# Altium schematic sheet Power.SchDoc: Power Converters
size 279 x 215 mm; DrawnBy: Kyle Hong; Engineer: Kyle Hong; Revision: 1; SheetNumber: 1; SheetTotal: 3
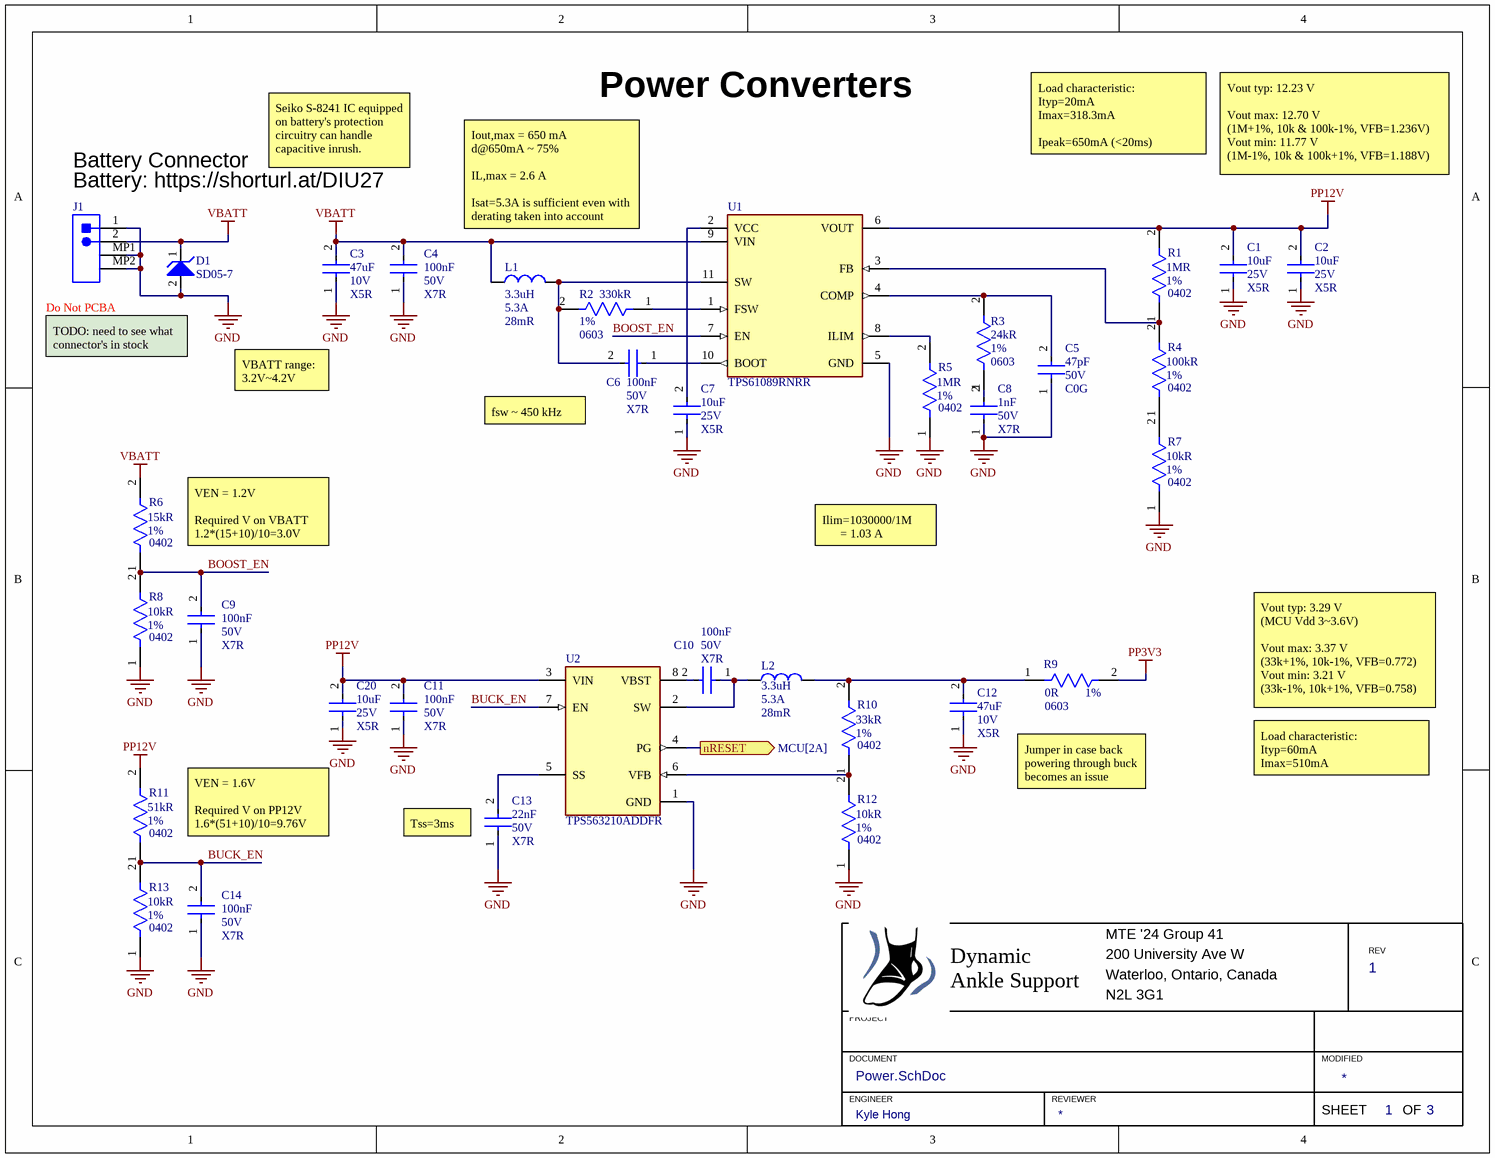
[diagram p0: Power.SchDoc]

## Parts
C1  Dielectric: X5R  Voltage Rating: 25V  Capacitance: 10uF  [CAP0805]  (hidden comment: CL21A106KAYNNNE)
C2  Dielectric: X5R  Voltage Rating: 25V  Capacitance: 10uF  [CAP0805]  (hidden comment: CL21A106KAYNNNE)
C3  Dielectric: X5R  Voltage Rating: 10V  Capacitance: 47uF  [CAP1206]  (hidden comment: CL31A476MPHNNNE)
C4  Dielectric: X7R  Voltage Rating: 50V  Capacitance: 100nF  [CAP0402]  (hidden comment: CL05B104KB54PNC)
C5  Dielectric: C0G  Voltage Rating: 50V  Capacitance: 47pF  [CAP0402]  (hidden comment: 0402CG470J500NT)
C6  Dielectric: X7R  Voltage Rating: 50V  Capacitance: 100nF  [CAP0402]  (hidden comment: CL05B104KB54PNC)
C7  Dielectric: X5R  Voltage Rating: 25V  Capacitance: 10uF  [CAP0805]  (hidden comment: CL21A106KAYNNNE)
C8  Dielectric: X7R  Voltage Rating: 50V  Capacitance: 1nF  [CAP0402]  (hidden comment: 0402B102K500NT)
C9  Dielectric: X7R  Voltage Rating: 50V  Capacitance: 100nF  [CAP0402]  (hidden comment: CL05B104KB54PNC)
C10  Dielectric: X7R  Voltage Rating: 50V  Capacitance: 100nF  [CAP0402]  (hidden comment: CL05B104KB54PNC)
C11  Dielectric: X7R  Voltage Rating: 50V  Capacitance: 100nF  [CAP0402]  (hidden comment: CL05B104KB54PNC)
C12  Dielectric: X5R  Voltage Rating: 10V  Capacitance: 47uF  [CAP1206]  (hidden comment: CL31A476MPHNNNE)
C13  Dielectric: X7R  Voltage Rating: 50V  Capacitance: 22nF  [CAP0402]  (hidden comment: 0402B223K500NT)
C14  Dielectric: X7R  Voltage Rating: 50V  Capacitance: 100nF  [CAP0402]  (hidden comment: CL05B104KB54PNC)
C20  Dielectric: X5R  Voltage Rating: 25V  Capacitance: 10uF  [CAP0805]  (hidden comment: CL21A106KAYNNNE)
D1  SD05-7  [SD05-7]
J1  S2B-PH-SM4-TB(LF)(SN)  [JST- S2B-PH-SM4-TB(LF)(SN)-2_V]  (value not drawn)
L1  DC Resistance: 28mR  Isat(min): 5.3A  Inductance: 3.3uH  [TMPA0503S-3R3MN-D]  (hidden comment: TMPA0503S-3R3MN-D)
L2  DC Resistance: 28mR  Isat(min): 5.3A  Inductance: 3.3uH  [TMPA0503S-3R3MN-D]  (hidden comment: TMPA0503S-3R3MN-D)
R1  Tolerance: 1%  Resistance: 1MR  Package: 0402  [RES0402]  (hidden comment: 0402WGF1004TCE)
R2  Tolerance: 1%  Resistance: 330kR  Package: 0603  [RES0603]  (hidden comment: 0603WAF3303T5E)
R3  Tolerance: 1%  Resistance: 24kR  Package: 0603  [RES0603]  (hidden comment: 0603WAF2402T5E)
R4  Tolerance: 1%  Resistance: 100kR  Package: 0402  [RES0402]  (hidden comment: 0402WGF1003TCE)
R5  Tolerance: 1%  Resistance: 1MR  Package: 0402  [RES0402]  (hidden comment: 0402WGF1004TCE)
R6  Tolerance: 1%  Resistance: 15kR  Package: 0402  [RES0402]  (hidden comment: 0402WGF1502TCE)
R7  Tolerance: 1%  Resistance: 10kR  Package: 0402  [RES0402]  (hidden comment: 0402WGF1002TCE)
R8  Tolerance: 1%  Resistance: 10kR  Package: 0402  [RES0402]  (hidden comment: 0402WGF1002TCE)
R9  Tolerance: 1%  Resistance: 0R  Package: 0603  [RES0603]  (hidden comment: 0603WAF0000T5E)
R10  Tolerance: 1%  Resistance: 33kR  Package: 0402  [RES0402]  (hidden comment: 0402WGF3302TCE)
R11  Tolerance: 1%  Resistance: 51kR  Package: 0402  [RES0402]  (hidden comment: 0402WGF5102TCE)
R12  Tolerance: 1%  Resistance: 10kR  Package: 0402  [RES0402]  (hidden comment: 0402WGF1002TCE)
R13  Tolerance: 1%  Resistance: 10kR  Package: 0402  [RES0402]  (hidden comment: 0402WGF1002TCE)
U1  TPS61089RNRR  [FP-RNR0011A-MFG]
U2  TPS563210ADDFR  [TPS563210ADDFR]

## Ports
nRESET (out, see MCU[2A])

## Nets
GND: C1.1 C2.1 C3.1 C4.1 C5.1 C7.1 C8.1 C9.1 C11.1 C12.1 C13.1 C14.1 C20.1 D1.2 J1.1 J1.MP1 J1.MP2 R5.1 R7.1 R8.1 R12.1 R13.1 U1.5(GND) U2.1(GND)
PP3V3: R9.2
PP12V: C1.2 C2.2 C11.2 C20.2 R1.2 R11.2 U1.6(VOUT) U2.3(VIN)
VBATT: C3.2 C4.2 D1.1 J1.2 L1.1 R6.2 U1.9(VIN)
BOOST_EN: C9.2 R6.1 R8.2 U1.7(EN)
BUCK_EN: C14.2 R11.1 R13.2 U2.7(EN)
nRESET: U2.4(PG) ; port nRESET
NetC5_2: C5.2 R3.2 U1.4(COMP)
NetC6_1: C6.1 U1.10(BOOT)
NetC6_2: C6.2 L1.2 R2.2 U1.11(SW)
NetC7_2: C7.2 U1.2(VCC)
NetC8_2: C8.2 R3.1
NetC10_1: C10.1 L2.1 U2.2(SW)
NetC10_2: C10.2 U2.8(VBST)
NetC12_2: C12.2 L2.2 R9.1 R10.2
NetC13_2: C13.2 U2.5(SS)
NetR1_1: R1.1 R4.2 U1.3(FB)
NetR2_1: R2.1 U1.1(FSW)
NetR4_1: R4.1 R7.2
NetR5_2: R5.2 U1.8(ILIM)
NetR10_1: R10.1 R12.2 U2.6(VFB)

## Notes on the sheet
- Power Converters
- Seiko S-8241 IC equipped on battery's protection circuitry can handle capacitive inrush.
- Load characteristic:
  Ityp=20mA
  Imax=318.3mA
  Ipeak=650mA (<20ms)
- Battery Connector
- (near J1) Battery: https://shorturl.at/DIU27
- Iout,max = 650 mA
  d@650mA ~ 75%
  IL,max = 2.6 A
  Isat=5.3A is sufficient even with derating taken into account
- Vout typ: 12.23 V
  Vout max: 12.70 V
  (1M+1%, 10k & 100k-1%, VFB=1.236V)
  Vout min: 11.77 V
  (1M-1%, 10k & 100k+1%, VFB=1.188V)
- (near J1) Do Not PCBA
- TODO: need to see what connector's in stock
- VBATT range: 3.2V~4.2V
- (near C6) fsw ~ 450 kHz
- VEN = 1.2V
  Required V on VBATT
  1.2*(15+10)/10=3.0V
- Ilim=1030000/1M
  = 1.03 A
- Vout typ: 3.29 V
  (MCU Vdd 3~3.6V)
  Vout max: 3.37 V
  (33k+1%, 10k-1%, VFB=0.772)
  Vout min: 3.21 V
  (33k-1%, 10k+1%, VFB=0.758)
- Load characteristic:
  Ityp=60mA
  Imax=510mA
- VEN = 1.6V
  Required V on PP12V
  1.6*(51+10)/10=9.76V
- (near C13) Tss=3ms
- Jumper in case back powering through buck becomes an issue
- 200 University Ave W
- MTE '24 Group 41
- REV
- PROJECT
- Dynamic Ankle Support
- Waterloo, Ontario, Canada
- N2L 3G1
- DOCUMENT
- ENGINEER
- REVIEWER
- MODIFIED
- SHEET
- OF

## Library data of the parts
C1 C2 C7 C20 = CAP0805: 25V 10uF X5R ±10% 0805  Multilayer Ceramic Capacitors MLCC - SMD/SMT ROHS; Manufacturer: Samsung Electro-Mechanics; Tolerance: 10%; Manufacturer Part Number: CL21A106KAYNNNE; Package: 0805
C3 C12 = CAP1206: 10V 47uF X5R ±20% 1206  Multilayer Ceramic Capacitors MLCC - SMD/SMT ROHS; Manufacturer: Samsung Electro-Mechanics; Tolerance: 20%; Manufacturer Part Number: CL31A476MPHNNNE; Package: 1206
C4 C6 C9-C11 C14 = CAP0402: 50V 100nF X7R ±10% 0402  Multilayer Ceramic Capacitors MLCC - SMD/SMT ROHS; Manufacturer: Samsung Electro-Mechanics; Tolerance: ±20%; Manufacturer Part Number: CL05B104KB54PNC; Package: 0402
C5 = CAP0402: 50V 47pF C0G ±5% 0402  Multilayer Ceramic Capacitors MLCC - SMD/SMT ROHS; Manufacturer: FH (Guangdong Fenghua Advanced Tech); Tolerance: ±5%; Manufacturer Part Number: 0402CG470J500NT; Package: 0402
C8 = CAP0402: 50V 1nF X7R ±10% 0402  Multilayer Ceramic Capacitors MLCC - SMD/SMT ROHS; Manufacturer: FH (Guangdong Fenghua Advanced Tech); Tolerance: ±10%; Manufacturer Part Number: 0402B102K500NT; Package: 0402
C13 = CAP0402: 50V 22nF X7R ±10% 0402  Multilayer Ceramic Capacitors MLCC - SMD/SMT ROHS; Manufacturer: FH (Guangdong Fenghua Advanced Tech); Tolerance: 10%; Manufacturer Part Number: 0402B223K500NT; Package: 0402
D1 = SD05-7: TVS UNI14.5V 6.2V 5V SOD-323; Manufacturer: Diodes Incorporated; Clamping Voltage: 14.5V; Breakdown Voltage: 6.2V; Reverse Standoff Voltage: 5V; Package: SOD-323; Manufacturer Part Number: SD05-7
J1 = CMP-1755-00001-1: Male Header, Pitch 2 mm, 1 x 2 Position, Height 5.5 mm, -25 to 85 degC, RoHS, Tape and Reel; Current Rating: 3 A; ComponentLink1URL: http://www.jst.com/home2.html; Radiation Hardening: No; RoHSCompliant: True; Mount: Through Hole; Contact Material: Bronze; Package Quantity: 100; Width: 2.34 mm; DatasheetVersion: Dec-12; Height: 8.13 mm; Max Operating Temperature: 105degC; ComponentLink2Description: Datasheet; Lead Pitch: 0.1 inch; Contact Finish: Lead; Packaging: Bulk; Colour: Black; Contact Plating: Tin; Min Operating Temperature: -65degC; ComponentLink1Description: Manufacturer URL; PackageReference: S2B-PH-SM4-TB(LF)(SN)-2; PackageDescription: Male Header, Pitch 2 mm, 1 x 2 Position, Height 5.5 mm; ComponentLink2URL: http://www.jst-mfg.com/product/pdf/eng/ePH.pdf; Pins: 40; Length: 101.19 mm
L1 L2 = TMPA0503S-3R3MN-D: INDUCTOR 5.3A 3.3uH ±20% SMD Power Inductors ROHS; Manufacturer: TAI-TECH; Manufacturer Part Number: TMPA0503S-3R3MN-D; Tolerance: 20%
R1 R5 = RES0402: 62.5mW Thick Film Resistors ±100ppm/℃ ±1% 1MΩ 0402  Chip Resistor - Surface Mount ROHS; Manufacturer: UNI-ROYAL(Uniroyal Elec); Power Rating: 62.5mW; Manufacturer Part Number: 0402WGF1004TCE
R2 = RES0603: 100mW Thick Film Resistors ±100ppm/℃ ±1% 330kΩ 0603  Chip Resistor - Surface Mount ROHS; Manufacturer: UNI-ROYAL(Uniroyal Elec); Power Rating: 100mW; Manufacturer Part Number: 0603WAF3303T5E
R3 = RES0603: 100mW Thick Film Resistors ±100ppm/℃ ±1% 24kΩ 0603  Chip Resistor - Surface Mount ROHS; Manufacturer: UNI-ROYAL(Uniroyal Elec); Power Rating: 100mW; Manufacturer Part Number: 0603WAF2402T5E
R4 = RES0402: 62.5mW Thick Film Resistors ±100ppm/℃ ±1% 100kΩ 0402  Chip Resistor - Surface Mount ROHS; Manufacturer: UNI-ROYAL(Uniroyal Elec); Power Rating: 62.5mW; Manufacturer Part Number: 0402WGF1003TCE
R6 = RES0402: 62.5mW Thick Film Resistors ±100ppm/℃ ±1% 15kΩ 0402  Chip Resistor - Surface Mount ROHS; Manufacturer: UNI-ROYAL(Uniroyal Elec); Power Rating: 62.5mW; Manufacturer Part Number: 0402WGF1502TCE
R7 R8 R12 R13 = RES0402: 62.5mW Thick Film Resistors ±100ppm/℃ ±1% 10kΩ 0402  Chip Resistor - Surface Mount ROHS; Manufacturer: UNI-ROYAL(Uniroyal Elec); Power Rating: 62.5mW; Manufacturer Part Number: 0402WGF1002TCE
R9 = RES0603: 100mW Thick Film Resistors ±1% 0Ω 0603  Chip Resistor - Surface Mount ROHS; Manufacturer: UNI-ROYAL(Uniroyal Elec); Power Rating: 100mW; Manufacturer Part Number: 0603WAF0000T5E
R10 = RES0402: 62.5mW Thick Film Resistors ±100ppm/℃ ±1% 33kΩ 0402  Chip Resistor - Surface Mount ROHS; Manufacturer: UNI-ROYAL(Uniroyal Elec); Power Rating: 62.5mW; Manufacturer Part Number: 0402WGF3302TCE
R11 = RES0402: 62.5mW Thick Film Resistors ±100ppm/℃ ±1% 51kΩ 0402  Chip Resistor - Surface Mount ROHS; Manufacturer: UNI-ROYAL(Uniroyal Elec); Power Rating: 62.5mW; Manufacturer Part Number: 0402WGF5102TCE
U1 = CMP-04918-000107-1: IC REG BOOST ADJ 7A 11VQFN; Manufacturer: Texas Instruments; Nominal Supply Current: 10uA; Output Type: AdjustableProgrammable; Max Junction Temp: +125°C; Switching Frequency: 200-2200kHz; Min Supply Voltage: 2.7V; Output Current: 8.1-10A; Number Of Outputs: 1; Standoff Height: 0mm; Max Supply Voltage: 12V; Output Voltage: 4.5-12.6V; Max Duty Cycle: 90%; Automotive: No; Height: 1mm; Manufacturer Part Number: TPS61089RNRR; Temperature Range Low: -40°C; Temperature Range High: +85°C; Temperature: -40°C to +85°C; Package: 11VQFN; Digikey Description: IC REG BOOST ADJ 7A 11VQFN; Device Class L2: Power Management ICs; Category: IC; ComponentLink2Description: Datasheet; Device Class L3: Voltage Regulators - Switching; Lead Free: Yes; Octopart: https://octopart.com/tps61089rnrr-texas+instruments-68059594; RoHS: TRUE; ComponentLink2URL: http://www.ti.com/lit/ds/symlink/tps61089.pdf; Switching Topology: Boost; Device Class L1: Integrated Circuits (ICs)
U2 = TPS563210ADDFR: IC REG BUCK ADJ 3A SOT-23-8; Manufacturer: Texas Instruments; Supplier 1: Mouser; Supplier Part Number 1: 595-TPS563210ADDFR; Manufacturer Part Number: TPS563210ADDFR; Package: SOT-23-8